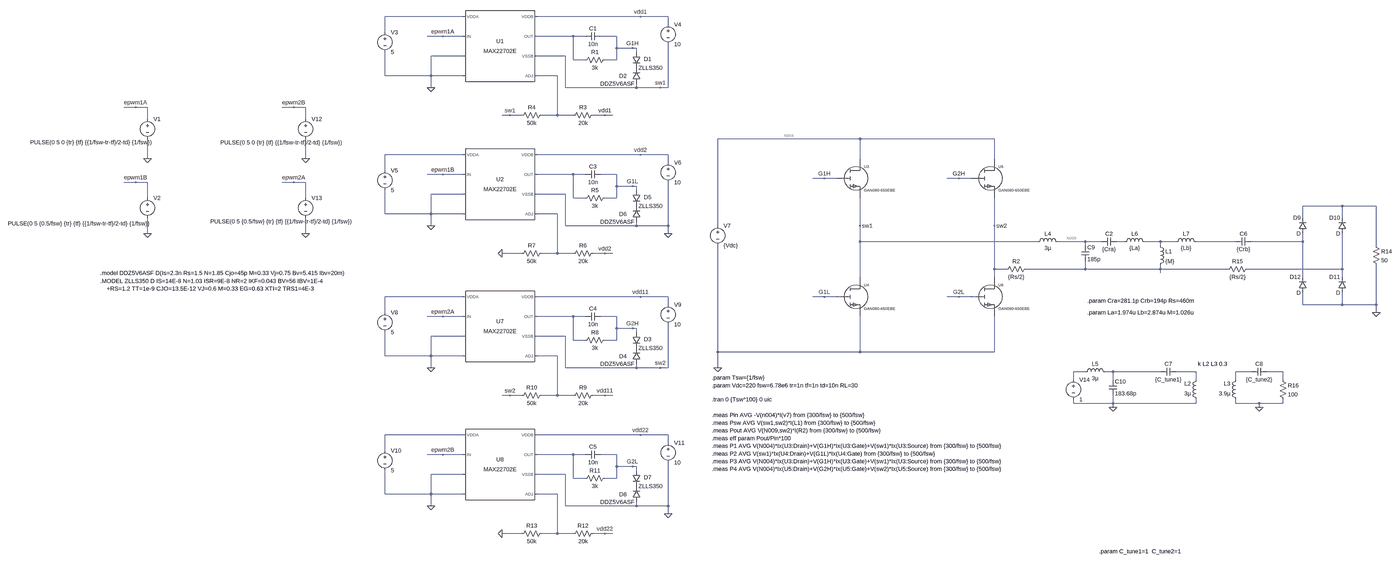
[diagram p0: schematic s_s_topology.asc, whole sheet]
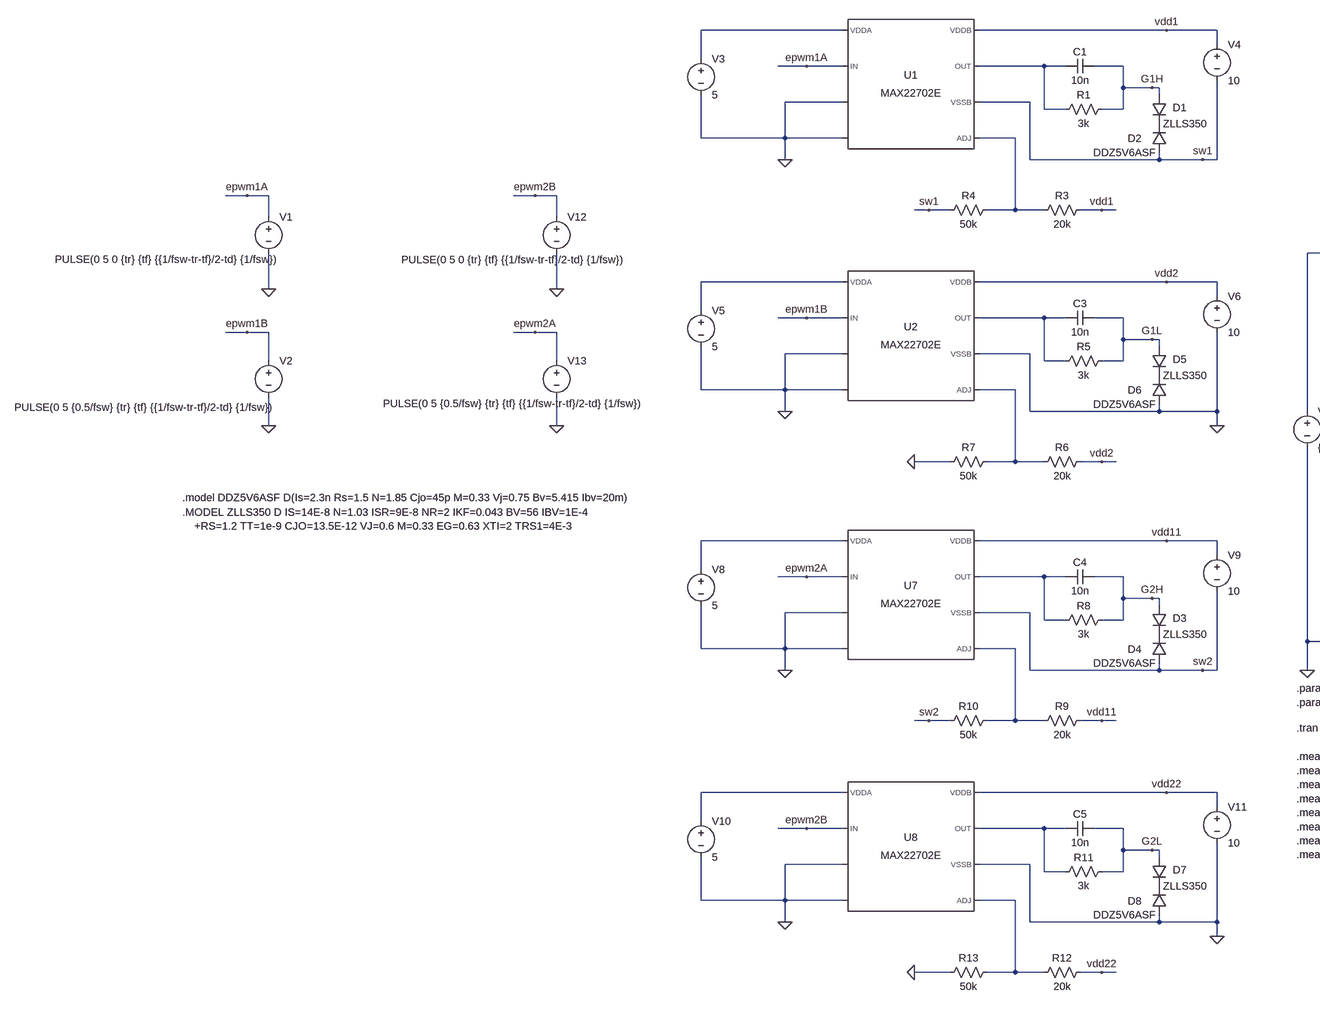
[diagram p1: schematic s_s_topology.asc, part, row 1 of 1, column 1 of 2]
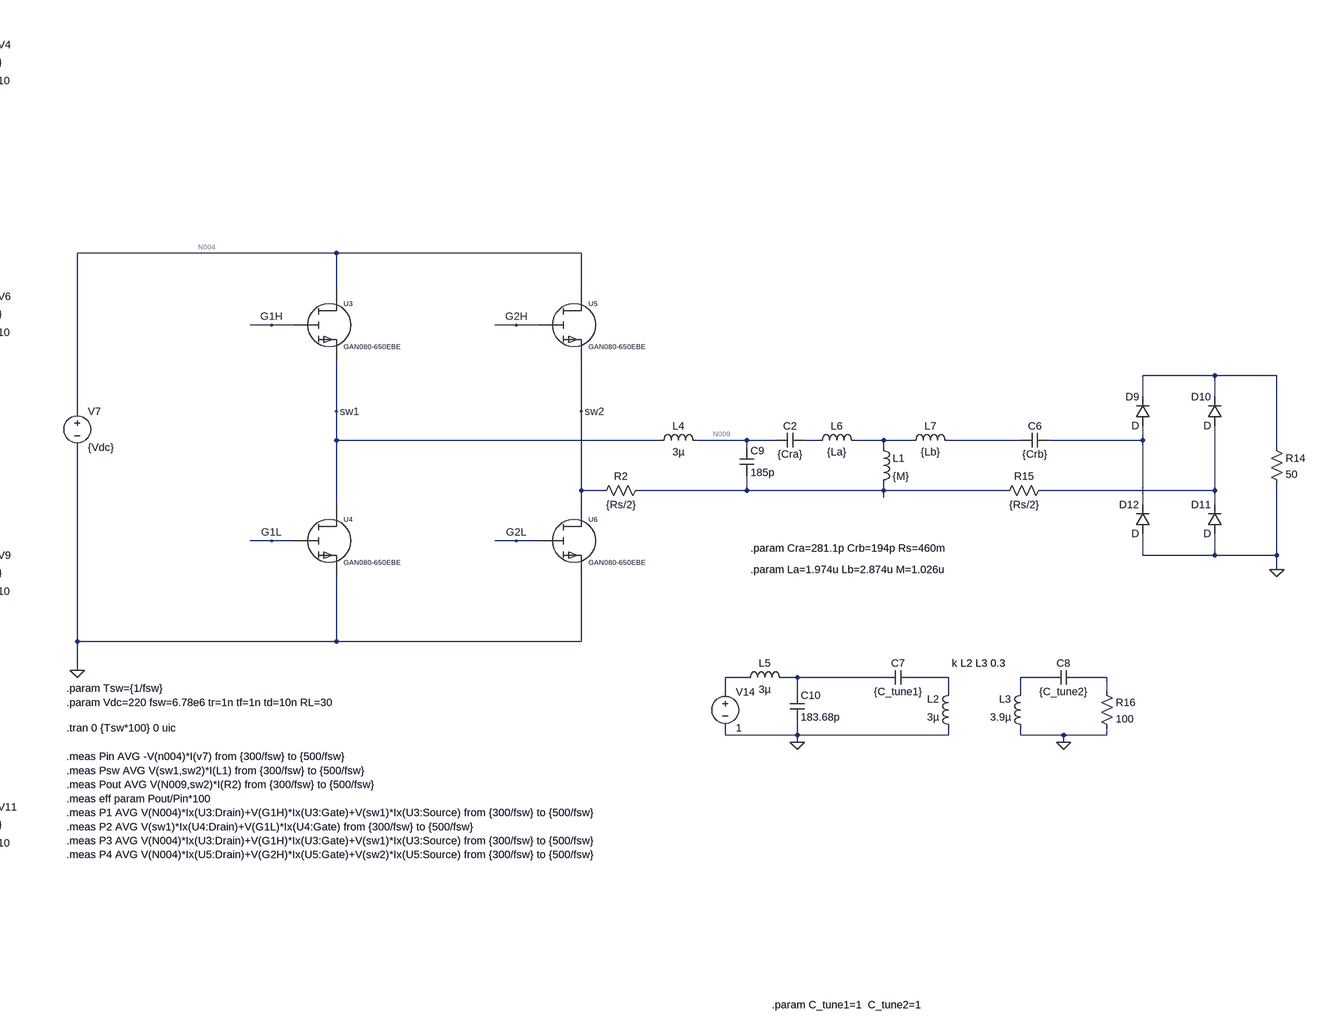
[diagram p2: schematic s_s_topology.asc, part, row 1 of 1, column 2 of 2]
s_s_topology.asc, the LTspice schematic file:
Version 4.1
SHEET 1 4712 1592
WIRE 352 -592 16 -592
WIRE 1072 -592 656 -592
WIRE 1184 -592 1072 -592
WIRE 1184 -560 1184 -592
WIRE 16 -528 16 -592
WIRE 272 -512 208 -512
WIRE 352 -512 272 -512
WIRE 800 -512 656 -512
WIRE 848 -512 800 -512
WIRE 976 -512 912 -512
WIRE 976 -464 976 -512
WIRE 1040 -464 976 -464
WIRE 1056 -464 1040 -464
WIRE 1056 -448 1056 -464
WIRE 352 -432 224 -432
WIRE 768 -432 656 -432
WIRE 800 -416 800 -512
WIRE 848 -416 800 -416
WIRE 976 -416 976 -464
WIRE 976 -416 928 -416
WIRE 16 -352 16 -448
WIRE 224 -352 224 -432
WIRE 224 -352 16 -352
WIRE 352 -352 224 -352
WIRE 736 -352 656 -352
WIRE 224 -304 224 -352
WIRE 768 -304 768 -432
WIRE 1056 -304 1056 -320
WIRE 1056 -304 768 -304
WIRE 1152 -304 1056 -304
WIRE 1184 -304 1184 -480
WIRE 1184 -304 1152 -304
WIRE -1328 -224 -1376 -224
WIRE -1280 -224 -1328 -224
WIRE -688 -224 -736 -224
WIRE -640 -224 -688 -224
WIRE 544 -192 512 -192
WIRE 592 -192 544 -192
WIRE 736 -192 736 -352
WIRE 736 -192 672 -192
WIRE 800 -192 736 -192
WIRE 928 -192 880 -192
WIRE 960 -192 928 -192
WIRE -1280 -176 -1280 -224
WIRE -640 -176 -640 -224
WIRE 2384 -96 1808 -96
WIRE 2928 -96 2384 -96
WIRE 352 -32 16 -32
WIRE 1072 -32 656 -32
WIRE 1184 -32 1072 -32
WIRE -1280 -16 -1280 -96
WIRE -640 -16 -640 -96
WIRE 2384 -16 2384 -96
WIRE 2928 -16 2928 -96
WIRE 1184 0 1184 -32
WIRE 16 32 16 -32
WIRE 272 48 208 48
WIRE 352 48 272 48
WIRE 800 48 656 48
WIRE 848 48 800 48
WIRE 976 48 912 48
WIRE 2240 64 2192 64
WIRE 2288 64 2240 64
WIRE 2784 64 2736 64
WIRE 2832 64 2784 64
WIRE -1328 80 -1376 80
WIRE -1280 80 -1328 80
WIRE -688 80 -736 80
WIRE -640 80 -688 80
WIRE 976 96 976 48
WIRE 1040 96 976 96
WIRE 1056 96 1040 96
WIRE 1056 112 1056 96
WIRE 352 128 224 128
WIRE 768 128 656 128
WIRE -1280 144 -1280 80
WIRE -640 144 -640 80
WIRE 800 144 800 48
WIRE 848 144 800 144
WIRE 976 144 976 96
WIRE 976 144 928 144
WIRE 4336 176 4176 176
WIRE 4512 176 4336 176
WIRE 16 208 16 112
WIRE 224 208 224 128
WIRE 224 208 16 208
WIRE 352 208 224 208
WIRE 736 208 656 208
WIRE 4176 224 4176 176
WIRE 4336 224 4336 176
WIRE 224 256 224 208
WIRE 768 256 768 128
WIRE 1056 256 1056 240
WIRE 1056 256 768 256
WIRE 1184 256 1184 80
WIRE 1184 256 1056 256
WIRE 1808 256 1808 -96
WIRE 2384 256 2384 144
WIRE 2928 256 2928 144
WIRE -1280 288 -1280 224
WIRE -640 288 -640 224
WIRE 1184 288 1184 256
WIRE 2384 320 2384 256
WIRE 3104 320 2384 320
WIRE 3296 320 3184 320
WIRE 3360 320 3296 320
WIRE 3456 320 3424 320
WIRE 3600 320 3536 320
WIRE 3664 320 3600 320
WIRE 3904 320 3744 320
WIRE 4176 320 4176 288
WIRE 4176 320 3968 320
WIRE 3296 336 3296 320
WIRE 3600 336 3600 320
WIRE 4512 336 4512 176
WIRE 592 368 512 368
WIRE 736 368 736 208
WIRE 736 368 672 368
WIRE 800 368 736 368
WIRE 928 368 880 368
WIRE 960 368 928 368
WIRE 2928 432 2928 256
WIRE 2976 432 2928 432
WIRE 3296 432 3296 400
WIRE 3296 432 3056 432
WIRE 3600 432 3600 416
WIRE 3600 432 3296 432
WIRE 3872 432 3600 432
WIRE 4336 432 4336 288
WIRE 4336 432 3952 432
WIRE 3600 448 3600 432
WIRE 2384 464 2384 320
WIRE 2928 464 2928 432
WIRE 4176 464 4176 320
WIRE 4336 464 4336 432
WIRE 352 544 16 544
WIRE 1072 544 656 544
WIRE 1184 544 1072 544
WIRE 2240 544 2192 544
WIRE 2288 544 2240 544
WIRE 2784 544 2736 544
WIRE 2832 544 2784 544
WIRE 1184 576 1184 544
WIRE 4176 576 4176 528
WIRE 4336 576 4336 528
WIRE 4336 576 4176 576
WIRE 4512 576 4512 416
WIRE 4512 576 4336 576
WIRE 16 608 16 544
WIRE 4512 608 4512 576
WIRE 272 624 208 624
WIRE 352 624 272 624
WIRE 800 624 656 624
WIRE 848 624 800 624
WIRE 976 624 912 624
WIRE 976 672 976 624
WIRE 1040 672 976 672
WIRE 1056 672 1040 672
WIRE 1056 688 1056 672
WIRE 352 704 224 704
WIRE 768 704 656 704
WIRE 800 720 800 624
WIRE 848 720 800 720
WIRE 976 720 976 672
WIRE 976 720 928 720
WIRE 1808 768 1808 336
WIRE 2384 768 2384 624
WIRE 2384 768 1808 768
WIRE 2928 768 2928 624
WIRE 2928 768 2384 768
WIRE 16 784 16 688
WIRE 224 784 224 704
WIRE 224 784 16 784
WIRE 352 784 224 784
WIRE 736 784 656 784
WIRE 224 832 224 784
WIRE 768 832 768 704
WIRE 1056 832 1056 816
WIRE 1056 832 768 832
WIRE 1152 832 1056 832
WIRE 1184 832 1184 656
WIRE 1184 832 1152 832
WIRE 1808 832 1808 768
WIRE 3296 848 3248 848
WIRE 3408 848 3376 848
WIRE 3600 848 3408 848
WIRE 3744 848 3664 848
WIRE 3968 848 3904 848
WIRE 4096 848 4032 848
WIRE 3248 880 3248 848
WIRE 3408 880 3408 848
WIRE 3744 880 3744 848
WIRE 3904 880 3904 848
WIRE 4096 880 4096 848
WIRE 544 944 512 944
WIRE 592 944 544 944
WIRE 736 944 736 784
WIRE 736 944 672 944
WIRE 800 944 736 944
WIRE 928 944 880 944
WIRE 960 944 928 944
WIRE 3248 976 3248 960
WIRE 3408 976 3408 944
WIRE 3408 976 3248 976
WIRE 3744 976 3744 960
WIRE 3744 976 3408 976
WIRE 3904 976 3904 960
WIRE 4000 976 3904 976
WIRE 4096 976 4096 960
WIRE 4096 976 4000 976
WIRE 3408 992 3408 976
WIRE 4000 992 4000 976
WIRE 352 1104 16 1104
WIRE 1072 1104 656 1104
WIRE 1184 1104 1072 1104
WIRE 1184 1136 1184 1104
WIRE 16 1168 16 1104
WIRE 272 1184 208 1184
WIRE 352 1184 272 1184
WIRE 800 1184 656 1184
WIRE 848 1184 800 1184
WIRE 976 1184 912 1184
WIRE 976 1232 976 1184
WIRE 1040 1232 976 1232
WIRE 1056 1232 1040 1232
WIRE 1056 1248 1056 1232
WIRE 352 1264 224 1264
WIRE 768 1264 656 1264
WIRE 800 1280 800 1184
WIRE 848 1280 800 1280
WIRE 976 1280 976 1232
WIRE 976 1280 928 1280
WIRE 16 1344 16 1248
WIRE 224 1344 224 1264
WIRE 224 1344 16 1344
WIRE 352 1344 224 1344
WIRE 736 1344 656 1344
WIRE 224 1392 224 1344
WIRE 768 1392 768 1264
WIRE 1056 1392 1056 1376
WIRE 1056 1392 768 1392
WIRE 1184 1392 1184 1216
WIRE 1184 1392 1056 1392
WIRE 1184 1424 1184 1392
WIRE 592 1504 512 1504
WIRE 736 1504 736 1344
WIRE 736 1504 672 1504
WIRE 800 1504 736 1504
WIRE 928 1504 880 1504
WIRE 960 1504 928 1504
FLAG -1328 -224 epwm1A
FLAG -1328 80 epwm1B
FLAG 1040 -464 G1H
FLAG -1280 -16 0
FLAG -1280 288 0
FLAG 272 -512 epwm1A
FLAG 224 -304 0
FLAG 544 -192 sw1
FLAG 928 -192 vdd1
FLAG 1072 -592 vdd1
FLAG 1040 96 G1L
FLAG 272 48 epwm1B
FLAG 224 256 0
FLAG 928 368 vdd2
FLAG 1072 -32 vdd2
FLAG 512 368 0
FLAG 1152 -304 sw1
FLAG 1184 288 0
FLAG 2384 256 sw1
FLAG 1808 832 0
FLAG 2240 64 G1H
FLAG 2240 544 G1L
FLAG 2928 256 sw2
FLAG 2784 64 G2H
FLAG 2784 544 G2L
FLAG 1040 672 G2H
FLAG 272 624 epwm2A
FLAG 224 832 0
FLAG 544 944 sw2
FLAG 928 944 vdd11
FLAG 1072 544 vdd11
FLAG 1040 1232 G2L
FLAG 272 1184 epwm2B
FLAG 224 1392 0
FLAG 928 1504 vdd22
FLAG 1072 1104 vdd22
FLAG 512 1504 0
FLAG 1152 832 sw2
FLAG 1184 1424 0
FLAG -688 80 epwm2A
FLAG -688 -224 epwm2B
FLAG -640 -16 0
FLAG -640 288 0
FLAG 3408 992 0
FLAG 4000 992 0
FLAG 4512 608 0
SYMBOL PowerProducts\\MAX22702E 496 -512 R0
SYMATTR InstName U1
SYMBOL voltage -1280 -192 R0
WINDOW 123 0 0 Left 0
WINDOW 39 -273 152 Left 2
WINDOW 3 -475 110 Left 2
SYMATTR Value PULSE(0 5 0 {tr} {tf} {{1/fsw-tr-tf}/2-td} {1/fsw})
SYMATTR InstName V1
SYMBOL voltage -1280 128 R0
WINDOW 123 0 0 Left 0
WINDOW 39 -302 150 Left 2
WINDOW 3 -565 119 Left 2
SYMATTR Value PULSE(0 5 {0.5/fsw} {tr} {tf} {{1/fsw-tr-tf}/2-td} {1/fsw})
SYMATTR InstName V2
SYMBOL diode 1040 -448 R0
WINDOW 0 46 28 Left 2
SYMATTR InstName D1
SYMATTR Value ZLLS350
SYMBOL res 944 -432 R90
WINDOW 0 0 56 VBottom 2
WINDOW 3 32 56 VTop 2
SYMATTR InstName R1
SYMATTR Value 3k
SYMBOL cap 912 -528 R90
WINDOW 0 0 32 VBottom 2
WINDOW 3 32 32 VTop 2
SYMATTR InstName C1
SYMATTR Value 10n
SYMBOL diode 1072 -320 R180
WINDOW 0 55 31 Left 2
WINDOW 3 24 0 Left 2
SYMATTR InstName D2
SYMATTR Value DDZ5V6ASF
SYMBOL voltage 16 -544 R0
WINDOW 123 0 0 Left 0
WINDOW 39 0 0 Left 0
SYMATTR InstName V3
SYMATTR Value 5
SYMBOL res 896 -208 R90
WINDOW 0 0 56 VBottom 2
WINDOW 3 32 56 VTop 2
SYMATTR InstName R3
SYMATTR Value 20k
SYMBOL res 688 -208 R90
WINDOW 0 0 56 VBottom 2
WINDOW 3 32 56 VTop 2
SYMATTR InstName R4
SYMATTR Value 50k
SYMBOL voltage 1184 -576 R0
WINDOW 123 0 0 Left 0
WINDOW 39 0 0 Left 0
SYMATTR InstName V4
SYMATTR Value 10
SYMBOL PowerProducts\\MAX22702E 496 48 R0
SYMATTR InstName U2
SYMBOL diode 1040 112 R0
WINDOW 0 46 28 Left 2
SYMATTR InstName D5
SYMATTR Value ZLLS350
SYMBOL res 944 128 R90
WINDOW 0 0 56 VBottom 2
WINDOW 3 32 56 VTop 2
SYMATTR InstName R5
SYMATTR Value 3k
SYMBOL cap 912 32 R90
WINDOW 0 0 32 VBottom 2
WINDOW 3 32 32 VTop 2
SYMATTR InstName C3
SYMATTR Value 10n
SYMBOL diode 1072 240 R180
WINDOW 0 55 31 Left 2
WINDOW 3 24 0 Left 2
SYMATTR InstName D6
SYMATTR Value DDZ5V6ASF
SYMBOL voltage 16 16 R0
WINDOW 123 0 0 Left 0
WINDOW 39 0 0 Left 0
SYMATTR InstName V5
SYMATTR Value 5
SYMBOL res 896 352 R90
WINDOW 0 0 56 VBottom 2
WINDOW 3 32 56 VTop 2
SYMATTR InstName R6
SYMATTR Value 20k
SYMBOL res 688 352 R90
WINDOW 0 0 56 VBottom 2
WINDOW 3 32 56 VTop 2
SYMATTR InstName R7
SYMATTR Value 50k
SYMBOL voltage 1184 -16 R0
WINDOW 123 0 0 Left 0
WINDOW 39 0 0 Left 0
SYMATTR InstName V6
SYMATTR Value 10
SYMBOL model\\GAN080-650EBE 2368 64 R0
SYMATTR InstName U3
SYMBOL model\\GAN080-650EBE 2368 544 R0
SYMATTR InstName U4
SYMBOL voltage 1808 240 R0
WINDOW 123 0 0 Left 0
WINDOW 39 0 0 Left 0
SYMATTR InstName V7
SYMATTR Value {Vdc}
SYMBOL model\\GAN080-650EBE 2912 64 R0
SYMATTR InstName U5
SYMBOL model\\GAN080-650EBE 2912 544 R0
SYMATTR InstName U6
SYMBOL PowerProducts\\MAX22702E 496 624 R0
SYMATTR InstName U7
SYMBOL diode 1040 688 R0
WINDOW 0 46 28 Left 2
SYMATTR InstName D3
SYMATTR Value ZLLS350
SYMBOL res 944 704 R90
WINDOW 0 0 56 VBottom 2
WINDOW 3 32 56 VTop 2
SYMATTR InstName R8
SYMATTR Value 3k
SYMBOL cap 912 608 R90
WINDOW 0 0 32 VBottom 2
WINDOW 3 32 32 VTop 2
SYMATTR InstName C4
SYMATTR Value 10n
SYMBOL diode 1072 816 R180
WINDOW 0 55 31 Left 2
WINDOW 3 24 0 Left 2
SYMATTR InstName D4
SYMATTR Value DDZ5V6ASF
SYMBOL voltage 16 592 R0
WINDOW 123 0 0 Left 0
WINDOW 39 0 0 Left 0
SYMATTR InstName V8
SYMATTR Value 5
SYMBOL res 896 928 R90
WINDOW 0 0 56 VBottom 2
WINDOW 3 32 56 VTop 2
SYMATTR InstName R9
SYMATTR Value 20k
SYMBOL res 688 928 R90
WINDOW 0 0 56 VBottom 2
WINDOW 3 32 56 VTop 2
SYMATTR InstName R10
SYMATTR Value 50k
SYMBOL voltage 1184 560 R0
WINDOW 123 0 0 Left 0
WINDOW 39 0 0 Left 0
SYMATTR InstName V9
SYMATTR Value 10
SYMBOL PowerProducts\\MAX22702E 496 1184 R0
SYMATTR InstName U8
SYMBOL diode 1040 1248 R0
WINDOW 0 46 28 Left 2
SYMATTR InstName D7
SYMATTR Value ZLLS350
SYMBOL res 944 1264 R90
WINDOW 0 0 56 VBottom 2
WINDOW 3 32 56 VTop 2
SYMATTR InstName R11
SYMATTR Value 3k
SYMBOL cap 912 1168 R90
WINDOW 0 0 32 VBottom 2
WINDOW 3 32 32 VTop 2
SYMATTR InstName C5
SYMATTR Value 10n
SYMBOL diode 1072 1376 R180
WINDOW 0 55 31 Left 2
WINDOW 3 24 0 Left 2
SYMATTR InstName D8
SYMATTR Value DDZ5V6ASF
SYMBOL voltage 16 1152 R0
WINDOW 123 0 0 Left 0
WINDOW 39 0 0 Left 0
SYMATTR InstName V10
SYMATTR Value 5
SYMBOL res 896 1488 R90
WINDOW 0 0 56 VBottom 2
WINDOW 3 32 56 VTop 2
SYMATTR InstName R12
SYMATTR Value 20k
SYMBOL res 688 1488 R90
WINDOW 0 0 56 VBottom 2
WINDOW 3 32 56 VTop 2
SYMATTR InstName R13
SYMATTR Value 50k
SYMBOL voltage 1184 1120 R0
WINDOW 123 0 0 Left 0
WINDOW 39 0 0 Left 0
SYMATTR InstName V11
SYMATTR Value 10
SYMBOL voltage -640 -192 R0
WINDOW 123 0 0 Left 0
WINDOW 39 -273 152 Left 2
WINDOW 3 -345 111 Left 2
SYMATTR Value PULSE(0 5 0 {tr} {tf} {{1/fsw-tr-tf}/2-td} {1/fsw})
SYMATTR InstName V12
SYMBOL voltage -640 128 R0
WINDOW 123 0 0 Left 0
WINDOW 39 -302 150 Left 2
WINDOW 3 -386 111 Left 2
SYMATTR Value PULSE(0 5 {0.5/fsw} {tr} {tf} {{1/fsw-tr-tf}/2-td} {1/fsw})
SYMATTR InstName V13
SYMBOL cap 3424 304 R90
WINDOW 0 0 32 VBottom 2
WINDOW 3 32 32 VTop 2
SYMATTR InstName C2
SYMATTR Value {Cra}
SYMATTR SpiceLine Rser=1m
SYMBOL res 3072 416 R90
WINDOW 0 0 56 VBottom 2
WINDOW 3 32 56 VTop 2
SYMATTR InstName R2
SYMATTR Value {Rs/2}
SYMBOL cap 3904 336 R270
WINDOW 0 32 32 VTop 2
WINDOW 3 0 32 VBottom 2
SYMATTR InstName C6
SYMATTR Value {Crb}
SYMATTR SpiceLine Rser=1m
SYMBOL res 4496 320 R0
SYMATTR InstName R14
SYMATTR Value 50
SYMBOL res 3968 416 R90
WINDOW 0 0 56 VBottom 2
WINDOW 3 32 56 VTop 2
SYMATTR InstName R15
SYMATTR Value {Rs/2}
SYMBOL diode 4192 288 R180
WINDOW 0 24 64 Left 2
WINDOW 3 24 0 Left 2
SYMATTR InstName D9
SYMBOL diode 4352 288 R180
WINDOW 0 24 64 Left 2
WINDOW 3 24 0 Left 2
SYMATTR InstName D10
SYMBOL diode 4352 528 R180
WINDOW 0 24 64 Left 2
WINDOW 3 24 0 Left 2
SYMATTR InstName D11
SYMBOL diode 4192 528 R180
WINDOW 0 24 64 Left 2
WINDOW 3 24 0 Left 2
SYMATTR InstName D12
SYMBOL ind 3584 320 R0
SYMATTR InstName L1
SYMATTR Value {M}
SYMATTR SpiceLine Rser=1m
SYMBOL ind 3760 976 R180
WINDOW 0 36 80 Left 2
WINDOW 3 36 40 Left 2
SYMATTR InstName L2
SYMATTR Value 3µ
SYMATTR Type ind
SYMATTR SpiceLine Rser=1m
SYMBOL ind 3920 976 R180
WINDOW 0 36 80 Left 2
WINDOW 3 36 40 Left 2
SYMATTR InstName L3
SYMATTR Value 3.9µ
SYMATTR Type ind
SYMATTR SpiceLine Rser=1m
SYMBOL cap 3664 832 R90
WINDOW 0 0 32 VBottom 2
WINDOW 3 32 32 VTop 2
SYMATTR InstName C7
SYMATTR Value {C_tune1}
SYMBOL cap 4032 832 R90
WINDOW 0 0 32 VBottom 2
WINDOW 3 32 32 VTop 2
SYMATTR InstName C8
SYMATTR Value {C_tune2}
SYMBOL ind 3088 336 R270
WINDOW 0 32 56 VTop 2
WINDOW 3 5 56 VBottom 2
SYMATTR InstName L4
SYMATTR Value 3µ
SYMATTR SpiceLine Rser=1m
SYMBOL cap 3280 336 R0
SYMATTR InstName C9
SYMATTR Value 185p
SYMATTR SpiceLine Rser=1m
SYMBOL ind 3280 864 R270
WINDOW 0 32 56 VTop 2
WINDOW 3 5 56 VBottom 2
SYMATTR InstName L5
SYMATTR Value 3µ
SYMATTR SpiceLine Rser=1m
SYMBOL cap 3392 880 R0
SYMATTR InstName C10
SYMATTR Value 183.68p
SYMBOL voltage 3248 864 R0
WINDOW 123 0 0 Left 0
WINDOW 39 0 0 Left 0
SYMATTR InstName V14
SYMATTR Value 1
SYMBOL res 4080 864 R0
SYMATTR InstName R16
SYMATTR Value 100
SYMBOL ind 3440 336 R270
WINDOW 0 32 56 VTop 2
WINDOW 3 5 56 VBottom 2
SYMATTR InstName L6
SYMATTR Value {La}
SYMATTR SpiceLine Rser=1m
SYMBOL ind 3648 336 R270
WINDOW 0 32 56 VTop 2
WINDOW 3 5 56 VBottom 2
SYMATTR InstName L7
SYMATTR Value {Lb}
SYMATTR SpiceLine Rser=1m
TEXT -1472 480 Left 2 !.MODEL ZLLS350 D IS=14E-8 N=1.03 ISR=9E-8 NR=2 IKF=0.043 BV=56 IBV=1E-4\n    +RS=1.2 TT=1e-9 CJO=13.5E-12 VJ=0.6 M=0.33 EG=0.63 XTI=2 TRS1=4E-3
TEXT -1472 448 Left 2 !.model DDZ5V6ASF D(Is=2.3n Rs=1.5 N=1.85 Cjo=45p M=0.33 Vj=0.75 Bv=5.415 Ibv=20m)
TEXT 1784 904 Left 2 !.param Vdc=220 fsw=6.78e6 tr=1n tf=1n td=10n RL=30
TEXT 1784 960 Left 2 !.tran 0 {Tsw*100} 0 uic
TEXT 1784 1024 Left 2 !.meas Pin AVG -V(n004)*I(v7) from {300/fsw} to {500/fsw}\n.meas Psw AVG V(sw1,sw2)*I(L1) from {300/fsw} to {500/fsw}\n.meas Pout AVG V(N009,sw2)*I(R2) from {300/fsw} to {500/fsw}\n.meas eff param Pout/Pin*100\n.meas P1 AVG V(N004)*Ix(U3:Drain)+V(G1H)*Ix(U3:Gate)+V(sw1)*Ix(U3:Source) from {300/fsw} to {500/fsw}\n.meas P2 AVG V(sw1)*Ix(U4:Drain)+V(G1L)*Ix(U4:Gate) from {300/fsw} to {500/fsw}\n.meas P3 AVG V(N004)*Ix(U3:Drain)+V(G1H)*Ix(U3:Gate)+V(sw1)*Ix(U3:Source) from {300/fsw} to {500/fsw}\n.meas P4 AVG V(N004)*Ix(U5:Drain)+V(G2H)*Ix(U5:Gate)+V(sw2)*Ix(U5:Source) from {300/fsw} to {500/fsw}
TEXT 1784 872 Left 2 !.param Tsw={1/fsw}
TEXT 3304 560 Left 2 !.param Cra=281.1p Crb=194p Rs=460m
TEXT 3304 608 Left 2 !.param La=1.974u Lb=2.874u M=1.026u
TEXT 3752 816 Left 2 !k L2 L3 0.3
TEXT 3352 1576 Left 2 !.param C_tune1=1  C_tune2=1

The netlist it stands for:
* s_s_topology.asc
X§U1 N001 epwm1A 0 0 vdd1 N002 N003 sw1 MAX22702E  ; pins VDDA IN ? ? VDDB OUT ADJ VSSB
V1 epwm1A 0 PULSE(0 5 0 {tr} {tf} {{1/fsw-tr-tf}/2-td} {1/fsw})
V2 epwm1B 0 PULSE(0 5 {0.5/fsw} {tr} {tf} {{1/fsw-tr-tf}/2-td} {1/fsw})
D1 G1H P001 ZLLS350
R1 G1H N002 3k
C1 G1H N002 10n
D2 sw1 P001 DDZ5V6ASF
V3 N001 0 5
R3 vdd1 N003 20k
R4 N003 sw1 50k
V4 vdd1 sw1 10
X§U2 N005 epwm1B 0 0 vdd2 N006 N008 0 MAX22702E  ; pins VDDA IN ? ? VDDB OUT ADJ VSSB
D5 G1L P002 ZLLS350
R5 G1L N006 3k
C3 G1L N006 10n
D6 0 P002 DDZ5V6ASF
V5 N005 0 5
R6 vdd2 N008 20k
R7 N008 0 50k
V6 vdd2 0 10
X§U3 N004 G1H sw1 GAN080-650EBE  ; pins Drain Gate Source
X§U4 sw1 G1L 0 GAN080-650EBE  ; pins Drain Gate Source
V7 N004 0 {Vdc}
X§U5 N004 G2H sw2 GAN080-650EBE  ; pins Drain Gate Source
X§U6 sw2 G2L 0 GAN080-650EBE  ; pins Drain Gate Source
X§U7 N016 epwm2A 0 0 vdd11 N017 N018 sw2 MAX22702E  ; pins VDDA IN ? ? VDDB OUT ADJ VSSB
D3 G2H P003 ZLLS350
R8 G2H N017 3k
C4 G2H N017 10n
D4 sw2 P003 DDZ5V6ASF
V8 N016 0 5
R9 vdd11 N018 20k
R10 N018 sw2 50k
V9 vdd11 sw2 10
X§U8 N024 epwm2B 0 0 vdd22 N025 N026 0 MAX22702E  ; pins VDDA IN ? ? VDDB OUT ADJ VSSB
D7 G2L P004 ZLLS350
R11 G2L N025 3k
C5 G2L N025 10n
D8 0 P004 DDZ5V6ASF
V10 N024 0 5
R12 vdd22 N026 20k
R13 N026 0 50k
V11 vdd22 0 10
V12 epwm2B 0 PULSE(0 5 0 {tr} {tf} {{1/fsw-tr-tf}/2-td} {1/fsw})
V13 epwm2A 0 PULSE(0 5 {0.5/fsw} {tr} {tf} {{1/fsw-tr-tf}/2-td} {1/fsw})
C2 N010 N009 {Cra} Rser=1m
R2 N014 sw2 {Rs/2}
C6 N012 N013 {Crb} Rser=1m
R14 N007 0 50
R15 N015 N014 {Rs/2}
D9 N013 N007 D
D10 N015 N007 D
D11 0 N015 D
D12 0 N013 D
L1 N011 N014 {M} Rser=1m
L2 0 N021 3µ Rser=1m
L3 0 N022 3.9µ Rser=1m
C7 N021 N020 {C_tune1}
C8 N023 N022 {C_tune2}
L4 sw1 N009 3µ Rser=1m
C9 N009 N014 185p Rser=1m
L5 N019 N020 3µ Rser=1m
C10 N020 0 183.68p
V14 N019 0 1
R16 N023 0 100
L6 N010 N011 {La} Rser=1m
L7 N011 N012 {Lb} Rser=1m
.model D D
.lib standard.dio
.MODEL ZLLS350 D IS=14E-8 N=1.03 ISR=9E-8 NR=2 IKF=0.043 BV=56 IBV=1E-4
    +RS=1.2 TT=1e-9 CJO=13.5E-12 VJ=0.6 M=0.33 EG=0.63 XTI=2 TRS1=4E-3
.model DDZ5V6ASF D(Is=2.3n Rs=1.5 N=1.85 Cjo=45p M=0.33 Vj=0.75 Bv=5.415 Ibv=20m)
.param Vdc=220 fsw=6.78e6 tr=1n tf=1n td=10n RL=30
.tran 0 {Tsw*100} 0 uic
.meas Pin AVG -V(n004)*I(v7) from {300/fsw} to {500/fsw}
.meas Psw AVG V(sw1,sw2)*I(L1) from {300/fsw} to {500/fsw}
.meas Pout AVG V(N009,sw2)*I(R2) from {300/fsw} to {500/fsw}
.meas eff param Pout/Pin*100
.meas P1 AVG V(N004)*Ix(U3:Drain)+V(G1H)*Ix(U3:Gate)+V(sw1)*Ix(U3:Source) from {300/fsw} to {500/fsw}
.meas P2 AVG V(sw1)*Ix(U4:Drain)+V(G1L)*Ix(U4:Gate) from {300/fsw} to {500/fsw}
.meas P3 AVG V(N004)*Ix(U3:Drain)+V(G1H)*Ix(U3:Gate)+V(sw1)*Ix(U3:Source) from {300/fsw} to {500/fsw}
.meas P4 AVG V(N004)*Ix(U5:Drain)+V(G2H)*Ix(U5:Gate)+V(sw2)*Ix(U5:Source) from {300/fsw} to {500/fsw}
.param Tsw={1/fsw}
.param Cra=281.1p Crb=194p Rs=460m
.param La=1.974u Lb=2.874u M=1.026u
k L2 L3 0.3
.param C_tune1=1  C_tune2=1
.lib MAX22702E.sub
.lib GAN080-650EBE_LTspice.lib
.backanno
.end